# Altium schematic sheet SignalConditioner.SchDoc
size A4
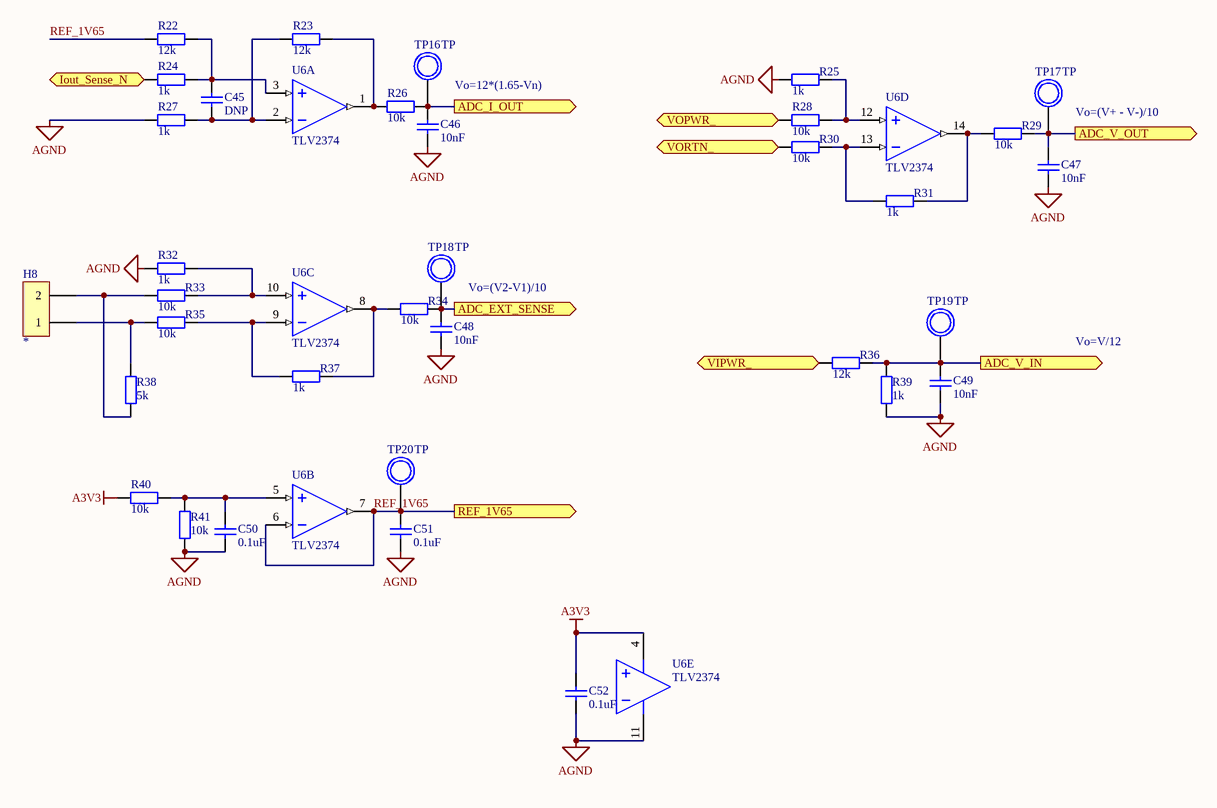
[diagram p0: SignalConditioner.SchDoc]

## Parts
C45  DNP  [CAP0603]
C46  10nF  [CAP0603]
C47  10nF  [CAP0603]
C48  10nF  [CAP0603]
C49  10nF  [CAP0603]
C50  0.1uF  [CAP0603]
C51  0.1uF  [CAP0603]
C52  0.1uF  [CAP0603]
H8  *  [KF301]
R22  12k  [RES0603]
R23  12k  [RES0603]
R24  1k  [RES0603]
R25  1k  [RES0603]
R26  10k  [RES0603]
R27  1k  [RES0603]
R28  10k  [RES0603]
R29  10k  [RES0603]
R30  10k  [RES0603]
R31  1k  [RES0603]
R32  1k  [RES0603]
R33  10k  [RES0603]
R34  10k  [RES0603]
R35  10k  [RES0603]
R36  12k  [RES0603]
R37  1k  [RES0603]
R38  5k  [RES0603]
R39  1k  [RES0603]
R40  10k  [RES0603]
R41  10k  [RES0603]
TP16  TP  [PAD85R]
TP17  TP  [PAD85R]
TP18  TP  [PAD85R]
TP19  TP  [PAD85R]
TP20  TP  [PAD85R]
U6  TLV2374  [SOIC127P600X175-14N]  (parts A,B,C,D,E of 5)

## Ports
ADC_EXT_SENSE (out), ADC_I_OUT (out), ADC_V_IN (out), ADC_V_OUT (out), Iout_Sense_N (in), REF_1V65 (out), VIPWR_ (bidir), VOPWR_ (bidir), VORTN_ (bidir)

## Nets
A3V3: C52.1 R40.2 U6.4(V-)
AGND: C46.2 C47.2 C48.2 C49.2 C50.2 C51.2 C52.2 R25.2 R27.1 R32.1 R39.2 R41.1 U6.11(V+)
ADC_EXT_SENSE: C48.1 R34.2 TP18.1 ; port ADC_EXT_SENSE
ADC_I_OUT: C46.1 R26.2 TP16.1 ; port ADC_I_OUT
ADC_V_IN: C49.1 R36.1 R39.1 TP19.1 ; port ADC_V_IN
ADC_V_OUT: C47.1 R29.1 TP17.1 ; port ADC_V_OUT
Iout_Sense_N: R24.1 ; port Iout_Sense_N
REF_1V65: C51.1 R22.1 TP20.1 U6.6(IN-) U6.7(OUT) ; port REF_1V65
VIPWR_: R36.2 ; port VIPWR_
VOPWR_: R28.2 ; port VOPWR_
VORTN_: R30.2 ; port VORTN_
NetC45_1: C45.1 R22.2 R24.2 U6.3(IN+)
NetC45_2: C45.2 R23.1 R27.2 U6.2(IN-)
NetC50_1: C50.1 R40.1 R41.2 U6.5(IN+)
NetH8_1: H8.1 R35.1 R38.2
NetH8_2: H8.2 R33.1 R38.1
NetR23_2: R23.2 R26.1 U6.1(OUT)
NetR25_1: R25.1 R28.1 U6.12(IN+)
NetR29_2: R29.2 R31.1 U6.14(OUT)
NetR30_1: R30.1 R31.2 U6.13(IN-)
NetR32_2: R32.2 R33.2 U6.10(IN+)
NetR34_1: R34.1 R37.2 U6.8(OUT)
NetR35_2: R35.2 R37.1 U6.9(IN-)

## Notes on the sheet
- Vo=12*(1.65-Vn)
- (near TP17) Vo=(V+ - V-)/10
- Vo=(V2-V1)/10
- Vo=V/12

## Library data of the parts
C45-C49 = CAP: CAP NON-POL; Tolerance: +/-10%; Rated Voltage: 50V; Capacitance Value: 0.1uF
C50-C52 = CAP: CAP NON-POL; Tolerance: +/-10%; Rated Voltage: 50V; Capacitance Value: 0.1uF
H8 = Connector-2P
R22-R41 = RES
TP16-TP20 = Test_Point: test point
U6 = TLV2374: 550uA/Ch 3-MHz RAIL-TO-RAIL INPUT/OUTPUT OPERATIONAL AMPLIFIERS